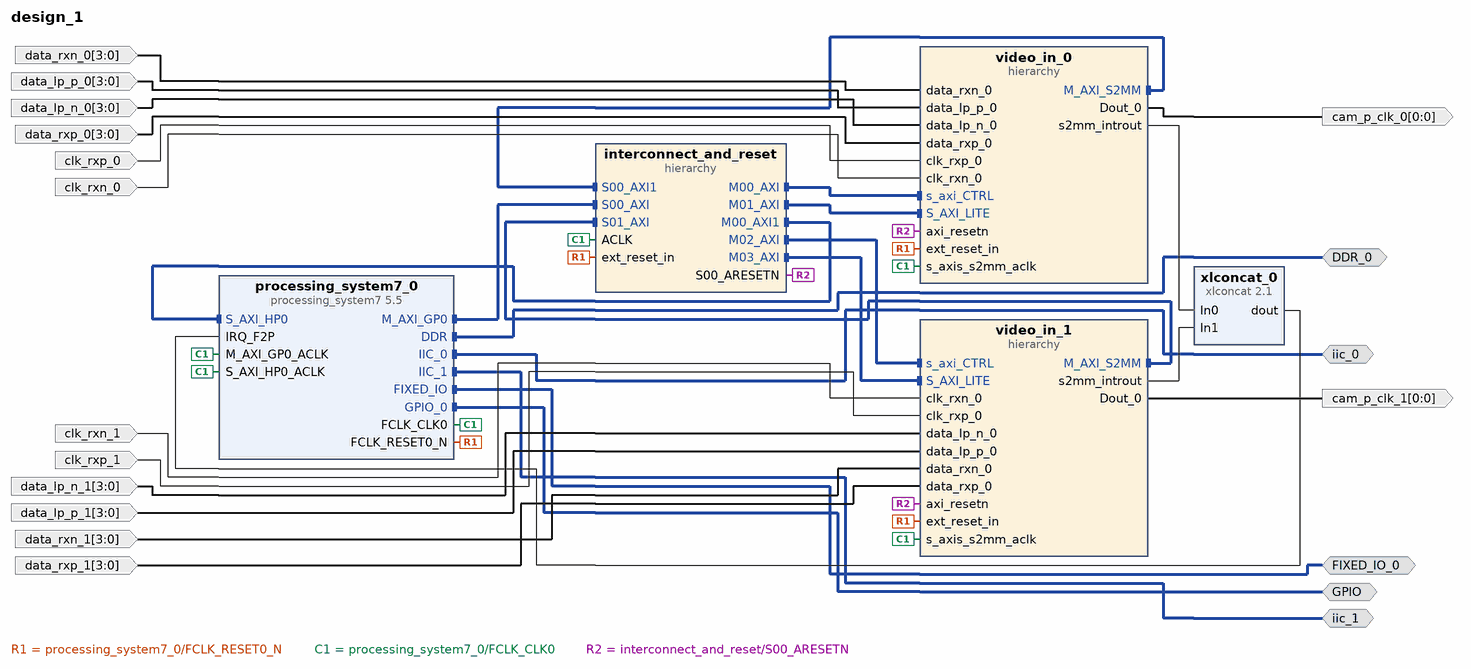
[diagram p0: block diagram of the top level]
# Vivado block design design_1, xc7z020clg484-1, Vivado 2018.2
create_bd_design design_1

create_bd_intf_port -mode Master -vlnv xilinx.com:interface:ddrx_rtl:1.0 DDR_0
create_bd_intf_port -mode Master -vlnv xilinx.com:interface:iic_rtl:1.0 iic_0
create_bd_intf_port -mode Master -vlnv xilinx.com:interface:iic_rtl:1.0 iic_1
create_bd_intf_port -mode Master -vlnv xilinx.com:display_processing_system7:fixedio_rtl:1.0 FIXED_IO_0
create_bd_intf_port -mode Master -vlnv xilinx.com:interface:gpio_rtl:1.0 GPIO
create_bd_port -dir I -from 3 -to 0 data_rxn_0
create_bd_port -dir I -from 3 -to 0 data_lp_p_0
create_bd_port -dir I -from 3 -to 0 data_lp_n_0
create_bd_port -dir I -from 3 -to 0 data_rxp_0
create_bd_port -dir I clk_rxp_0
create_bd_port -dir I clk_rxn_0
create_bd_port -dir O -from 0 -to 0 cam_p_clk_0
create_bd_port -dir O -from 0 -to 0 cam_p_clk_1
create_bd_port -dir I clk_rxn_1
create_bd_port -dir I clk_rxp_1
create_bd_port -dir I -from 3 -to 0 data_lp_n_1
create_bd_port -dir I -from 3 -to 0 data_lp_p_1
create_bd_port -dir I -from 3 -to 0 data_rxn_1
create_bd_port -dir I -from 3 -to 0 data_rxp_1

create_bd_cell -type hier video_in_0
create_bd_cell -type hier video_in_1
create_bd_cell -type hier interconnect_and_reset
create_bd_cell -type ip -vlnv xilinx.com:ip:processing_system7:5.5 processing_system7_0
set_property -dict [list \
  CONFIG.PCW_FCLK_CLK1_BUF TRUE \
  CONFIG.PCW_UIPARAM_DDR_FREQ_MHZ 533.333333 \
  CONFIG.PCW_CPU_CPU_6X4X_MAX_RANGE 800 \
  CONFIG.PCW_APU_PERIPHERAL_FREQMHZ 666.666666 \
  CONFIG.PCW_SDIO_PERIPHERAL_FREQMHZ 100 \
  CONFIG.PCW_UART_PERIPHERAL_FREQMHZ 100 \
  CONFIG.PCW_I2C_PERIPHERAL_FREQMHZ 111.111115 \
  CONFIG.PCW_FPGA0_PERIPHERAL_FREQMHZ 200 \
  CONFIG.PCW_FPGA1_PERIPHERAL_FREQMHZ 50 \
  CONFIG.PCW_USE_S_AXI_HP0 1 \
  CONFIG.PCW_USE_FABRIC_INTERRUPT 1 \
  CONFIG.PCW_EN_CLK1_PORT 1 \
  CONFIG.PCW_IRQ_F2P_INTR 1 \
  CONFIG.PCW_PERIPHERAL_BOARD_PRESET None \
  CONFIG.PCW_PRESET_BANK1_VOLTAGE {LVCMOS 3.3V} \
  CONFIG.PCW_UIPARAM_DDR_PARTNO {MT41J256M16 RE-125} \
  CONFIG.PCW_QSPI_PERIPHERAL_ENABLE 0 \
  CONFIG.PCW_ENET0_PERIPHERAL_ENABLE 1 \
  CONFIG.PCW_ENET0_ENET0_IO EMIO \
  CONFIG.PCW_ENET0_GRP_MDIO_ENABLE 1 \
  CONFIG.PCW_ENET0_GRP_MDIO_IO EMIO \
  CONFIG.PCW_ENET_RESET_ENABLE 1 \
  CONFIG.PCW_ENET_RESET_SELECT {Share reset pin} \
  CONFIG.PCW_ENET0_RESET_ENABLE 1 \
  CONFIG.PCW_ENET0_RESET_IO {MIO 0} \
  CONFIG.PCW_SD0_PERIPHERAL_ENABLE 1 \
  CONFIG.PCW_SD0_SD0_IO {MIO 40 .. 45} \
  CONFIG.PCW_SD0_GRP_CD_ENABLE 0 \
  CONFIG.PCW_SD0_GRP_WP_ENABLE 0 \
  CONFIG.PCW_UART0_PERIPHERAL_ENABLE 1 \
  CONFIG.PCW_UART0_UART0_IO EMIO \
  CONFIG.PCW_UART1_PERIPHERAL_ENABLE 0 \
  CONFIG.PCW_USB0_PERIPHERAL_ENABLE 1 \
  CONFIG.PCW_USB0_USB0_IO {MIO 28 .. 39} \
  CONFIG.PCW_USB_RESET_ENABLE 1 \
  CONFIG.PCW_USB_RESET_SELECT {Share reset pin} \
  CONFIG.PCW_USB0_RESET_ENABLE 1 \
  CONFIG.PCW_USB0_RESET_IO {MIO 4} \
  CONFIG.PCW_I2C0_PERIPHERAL_ENABLE 1 \
  CONFIG.PCW_I2C0_I2C0_IO EMIO \
  CONFIG.PCW_I2C0_RESET_ENABLE 1 \
  CONFIG.PCW_I2C0_RESET_IO {MIO 2} \
  CONFIG.PCW_I2C1_PERIPHERAL_ENABLE 1 \
  CONFIG.PCW_I2C1_I2C1_IO EMIO \
  CONFIG.PCW_I2C_RESET_ENABLE 1 \
  CONFIG.PCW_I2C_RESET_SELECT {Share reset pin} \
  CONFIG.PCW_GPIO_MIO_GPIO_ENABLE 1 \
  CONFIG.PCW_GPIO_MIO_GPIO_IO MIO \
  CONFIG.PCW_GPIO_EMIO_GPIO_ENABLE 1 \
  CONFIG.PCW_GPIO_EMIO_GPIO_IO 64 \
  CONFIG.PCW_FPGA_FCLK1_ENABLE 1 \
] [get_bd_cells processing_system7_0]
# 508 more settings of processing_system7_0 are not shown: defaults, MIO pin electricals, DDR timing, and values the tool derives
create_bd_cell -type ip -vlnv xilinx.com:ip:xlconcat:2.1 xlconcat_0

# ---- hierarchy /video_in_0 ----
current_bd_instance /video_in_0
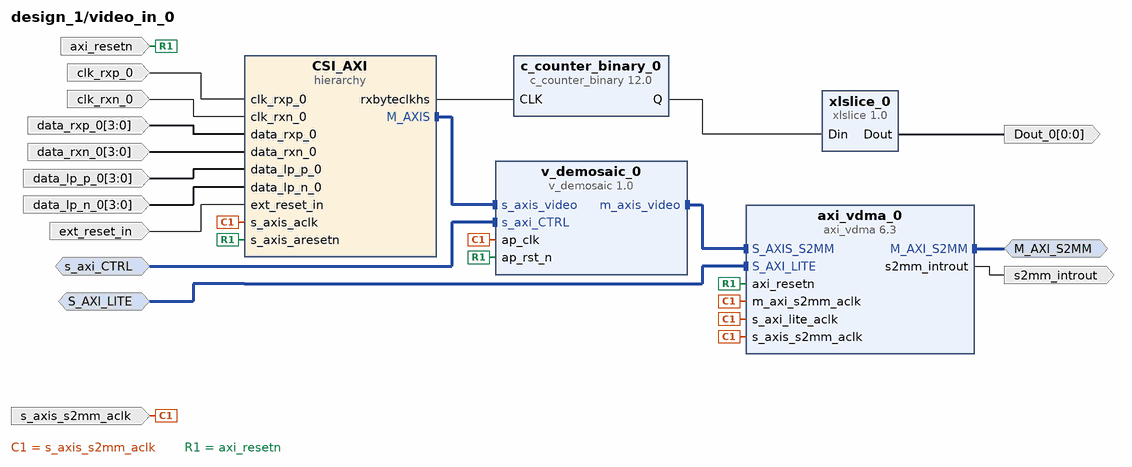
[diagram p1: block diagram inside /video_in_0]
create_bd_intf_pin -mode Master -vlnv xilinx.com:interface:aximm_rtl:1.0 M_AXI_S2MM
create_bd_intf_pin -mode Slave -vlnv xilinx.com:interface:aximm_rtl:1.0 s_axi_CTRL
create_bd_intf_pin -mode Slave -vlnv xilinx.com:interface:aximm_rtl:1.0 S_AXI_LITE
create_bd_pin -dir O -from 0 -to 0 Dout_0
create_bd_pin -dir I -type clk s_axis_s2mm_aclk
create_bd_pin -dir I -type rst axi_resetn
create_bd_pin -dir I clk_rxp_0
create_bd_pin -dir I clk_rxn_0
create_bd_pin -dir I -from 3 -to 0 data_rxp_0
create_bd_pin -dir I -from 3 -to 0 data_rxn_0
create_bd_pin -dir I -from 3 -to 0 data_lp_p_0
create_bd_pin -dir I -from 3 -to 0 data_lp_n_0
create_bd_pin -dir I -type rst ext_reset_in
create_bd_pin -dir O -type intr s2mm_introut

create_bd_cell -type hier CSI_AXI
create_bd_cell -type ip -vlnv xilinx.com:ip:axi_vdma:6.3 axi_vdma_0
set_property -dict [list \
  CONFIG.c_include_s2mm_dre 1 \
  CONFIG.c_s2mm_genlock_mode 0 \
  CONFIG.c_s2mm_linebuffer_depth 2048 \
  CONFIG.c_include_mm2s 0 \
  CONFIG.c_s2mm_max_burst_length 64 \
] [get_bd_cells axi_vdma_0]
create_bd_cell -type ip -vlnv xilinx.com:ip:c_counter_binary:12.0 c_counter_binary_0
set_property -dict {CONFIG.Output_Width 24} [get_bd_cells c_counter_binary_0]
create_bd_cell -type ip -vlnv xilinx.com:ip:v_demosaic:1.0 v_demosaic_0
set_property -dict [list \
  CONFIG.MAX_COLS 2560 \
  CONFIG.MAX_ROWS 1440 \
  CONFIG.MAX_DATA_WIDTH 10 \
  CONFIG.ENABLE_ZIPPER_REMOVAL false \
] [get_bd_cells v_demosaic_0]
create_bd_cell -type ip -vlnv xilinx.com:ip:xlslice:1.0 xlslice_0
set_property -dict {CONFIG.DIN_TO 23 CONFIG.DIN_FROM 23 CONFIG.DIN_WIDTH 24 CONFIG.DOUT_WIDTH 1} [get_bd_cells xlslice_0]

# ---- hierarchy /video_in_0/CSI_AXI ----
current_bd_instance /video_in_0/CSI_AXI
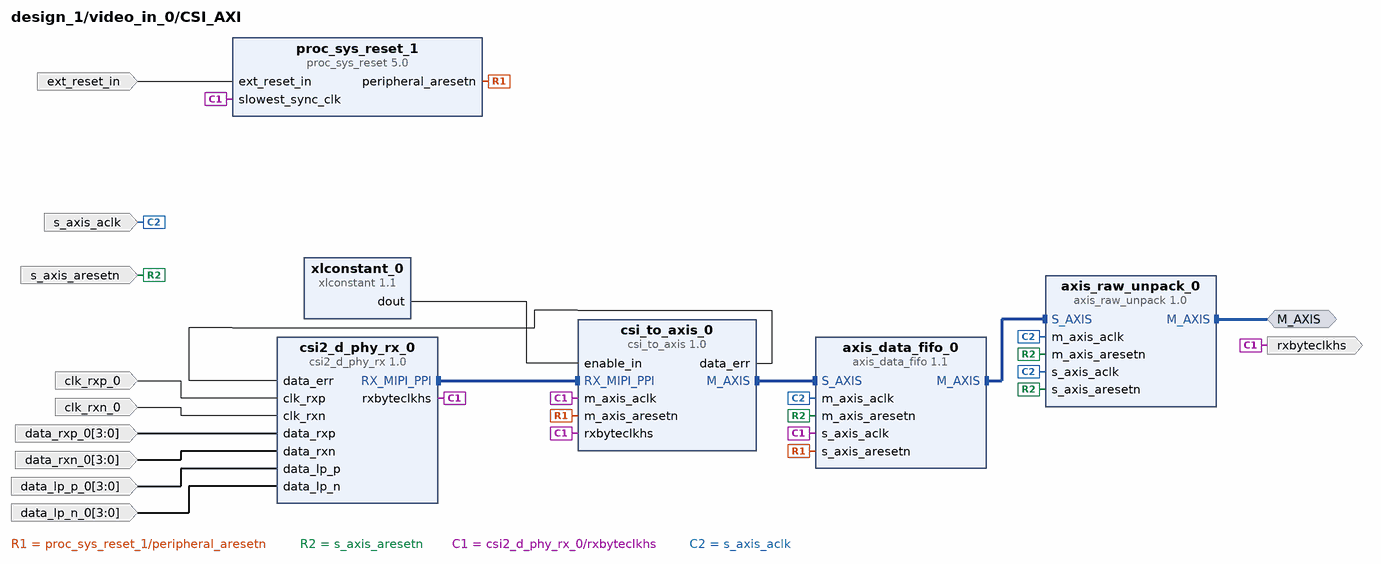
[diagram p2: block diagram inside /video_in_0/CSI_AXI]
create_bd_intf_pin -mode Master -vlnv xilinx.com:interface:axis_rtl:1.0 M_AXIS
create_bd_pin -dir I -type rst s_axis_aresetn
create_bd_pin -dir O rxbyteclkhs
create_bd_pin -dir I -type clk s_axis_aclk
create_bd_pin -dir I clk_rxp_0
create_bd_pin -dir I clk_rxn_0
create_bd_pin -dir I -from 3 -to 0 data_rxp_0
create_bd_pin -dir I -from 3 -to 0 data_rxn_0
create_bd_pin -dir I -from 3 -to 0 data_lp_p_0
create_bd_pin -dir I -from 3 -to 0 data_lp_n_0
create_bd_pin -dir I -type rst ext_reset_in

create_bd_cell -type ip -vlnv xilinx.com:ip:axis_data_fifo:1.1 axis_data_fifo_0
set_property -dict [list \
  CONFIG.TDATA_NUM_BYTES 4 \
  CONFIG.TUSER_WIDTH 1 \
  CONFIG.IS_ACLK_ASYNC 1 \
  CONFIG.HAS_TLAST 1 \
] [get_bd_cells axis_data_fifo_0]
create_bd_cell -type ip -vlnv trenz.biz:user:axis_raw_unpack:1.0 axis_raw_unpack_0
create_bd_cell -type ip -vlnv trenz.biz:user:csi2_d_phy_rx:1.0 csi2_d_phy_rx_0
set_property -dict {CONFIG.C_NUM_LANES 4 CONFIG.C_NUM_LP_LANES 4 CONFIG.C_USE_DELAY false} [get_bd_cells csi2_d_phy_rx_0]
create_bd_cell -type ip -vlnv trenz.biz:user:csi_to_axis:1.0 csi_to_axis_0
set_property -dict {CONFIG.C_LANES 4} [get_bd_cells csi_to_axis_0]
create_bd_cell -type ip -vlnv xilinx.com:ip:proc_sys_reset:5.0 proc_sys_reset_1
create_bd_cell -type ip -vlnv xilinx.com:ip:xlconstant:1.1 xlconstant_0

# ---- hierarchy /video_in_1 ----
current_bd_instance /video_in_1
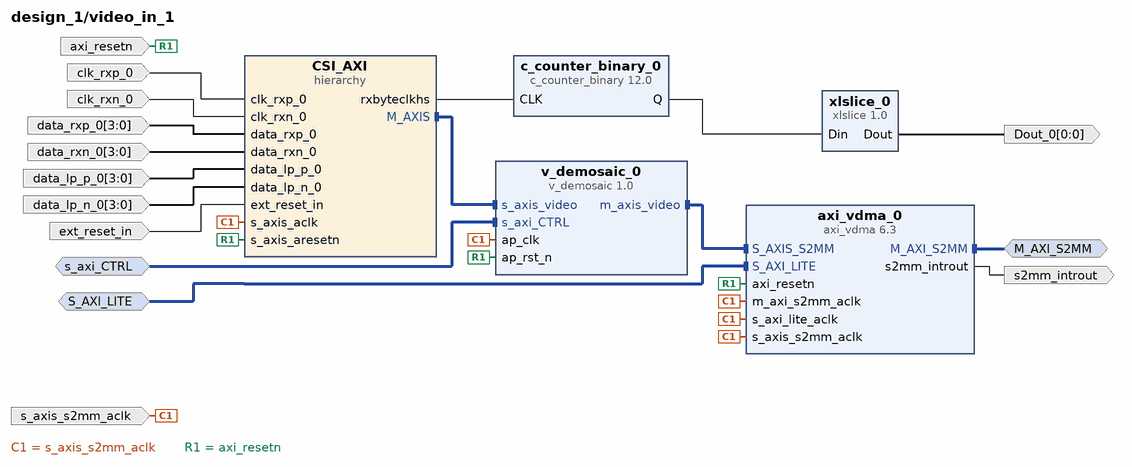
[diagram p3: block diagram inside /video_in_1]
create_bd_intf_pin -mode Master -vlnv xilinx.com:interface:aximm_rtl:1.0 M_AXI_S2MM
create_bd_intf_pin -mode Slave -vlnv xilinx.com:interface:aximm_rtl:1.0 s_axi_CTRL
create_bd_intf_pin -mode Slave -vlnv xilinx.com:interface:aximm_rtl:1.0 S_AXI_LITE
create_bd_pin -dir O -from 0 -to 0 Dout_0
create_bd_pin -dir I -type clk s_axis_s2mm_aclk
create_bd_pin -dir I -type rst axi_resetn
create_bd_pin -dir I clk_rxp_0
create_bd_pin -dir I clk_rxn_0
create_bd_pin -dir I -from 3 -to 0 data_rxp_0
create_bd_pin -dir I -from 3 -to 0 data_rxn_0
create_bd_pin -dir I -from 3 -to 0 data_lp_p_0
create_bd_pin -dir I -from 3 -to 0 data_lp_n_0
create_bd_pin -dir I -type rst ext_reset_in
create_bd_pin -dir O -type intr s2mm_introut

create_bd_cell -type hier CSI_AXI
create_bd_cell -type ip -vlnv xilinx.com:ip:axi_vdma:6.3 axi_vdma_0
set_property -dict [list \
  CONFIG.c_include_s2mm_dre 1 \
  CONFIG.c_s2mm_genlock_mode 0 \
  CONFIG.c_s2mm_linebuffer_depth 2048 \
  CONFIG.c_include_mm2s 0 \
  CONFIG.c_s2mm_max_burst_length 64 \
] [get_bd_cells axi_vdma_0]
create_bd_cell -type ip -vlnv xilinx.com:ip:c_counter_binary:12.0 c_counter_binary_0
set_property -dict {CONFIG.Output_Width 24} [get_bd_cells c_counter_binary_0]
create_bd_cell -type ip -vlnv xilinx.com:ip:v_demosaic:1.0 v_demosaic_0
set_property -dict [list \
  CONFIG.MAX_COLS 2560 \
  CONFIG.MAX_ROWS 1440 \
  CONFIG.MAX_DATA_WIDTH 10 \
  CONFIG.ENABLE_ZIPPER_REMOVAL false \
] [get_bd_cells v_demosaic_0]
create_bd_cell -type ip -vlnv xilinx.com:ip:xlslice:1.0 xlslice_0
set_property -dict {CONFIG.DIN_TO 23 CONFIG.DIN_FROM 23 CONFIG.DIN_WIDTH 24 CONFIG.DOUT_WIDTH 1} [get_bd_cells xlslice_0]

# ---- hierarchy /video_in_1/CSI_AXI ----
current_bd_instance /video_in_1/CSI_AXI
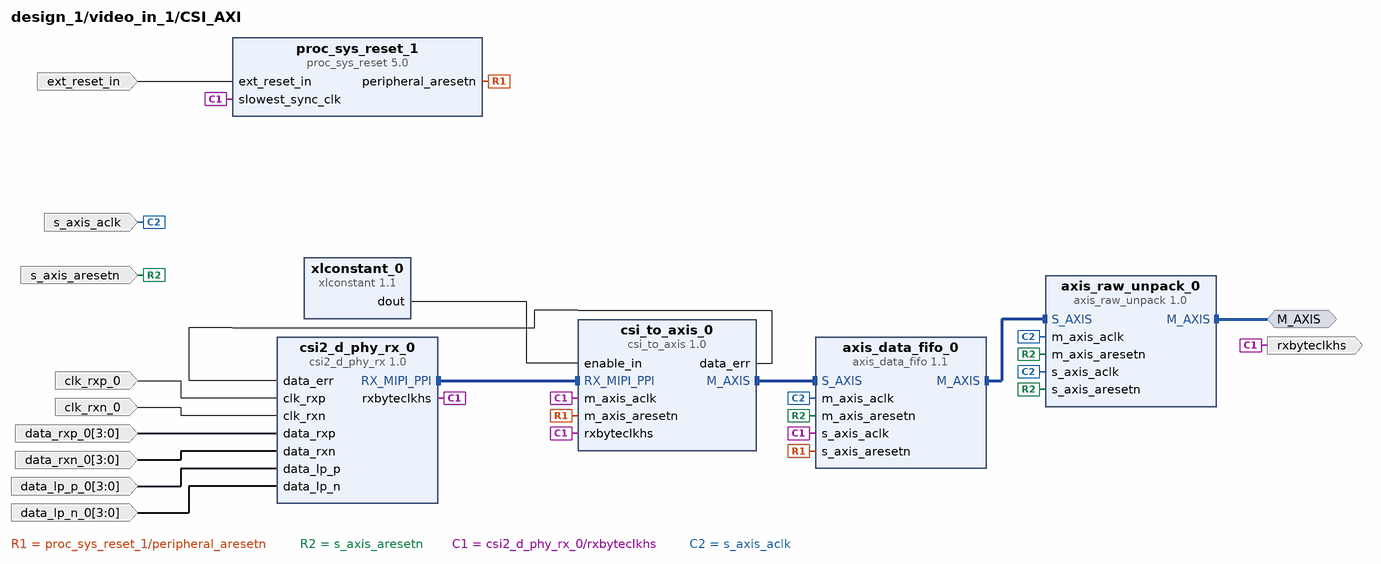
[diagram p4: block diagram inside /video_in_1/CSI_AXI]
create_bd_intf_pin -mode Master -vlnv xilinx.com:interface:axis_rtl:1.0 M_AXIS
create_bd_pin -dir I -type rst s_axis_aresetn
create_bd_pin -dir O rxbyteclkhs
create_bd_pin -dir I -type clk s_axis_aclk
create_bd_pin -dir I clk_rxp_0
create_bd_pin -dir I clk_rxn_0
create_bd_pin -dir I -from 3 -to 0 data_rxp_0
create_bd_pin -dir I -from 3 -to 0 data_rxn_0
create_bd_pin -dir I -from 3 -to 0 data_lp_p_0
create_bd_pin -dir I -from 3 -to 0 data_lp_n_0
create_bd_pin -dir I -type rst ext_reset_in

create_bd_cell -type ip -vlnv xilinx.com:ip:axis_data_fifo:1.1 axis_data_fifo_0
set_property -dict [list \
  CONFIG.TDATA_NUM_BYTES 4 \
  CONFIG.TUSER_WIDTH 1 \
  CONFIG.IS_ACLK_ASYNC 1 \
  CONFIG.HAS_TLAST 1 \
] [get_bd_cells axis_data_fifo_0]
create_bd_cell -type ip -vlnv trenz.biz:user:axis_raw_unpack:1.0 axis_raw_unpack_0
create_bd_cell -type ip -vlnv trenz.biz:user:csi2_d_phy_rx:1.0 csi2_d_phy_rx_0
set_property -dict {CONFIG.C_NUM_LANES 4 CONFIG.C_NUM_LP_LANES 4 CONFIG.C_USE_DELAY false} [get_bd_cells csi2_d_phy_rx_0]
create_bd_cell -type ip -vlnv trenz.biz:user:csi_to_axis:1.0 csi_to_axis_0
set_property -dict {CONFIG.C_LANES 4} [get_bd_cells csi_to_axis_0]
create_bd_cell -type ip -vlnv xilinx.com:ip:proc_sys_reset:5.0 proc_sys_reset_1
create_bd_cell -type ip -vlnv xilinx.com:ip:xlconstant:1.1 xlconstant_0

# ---- hierarchy /interconnect_and_reset ----
current_bd_instance /interconnect_and_reset
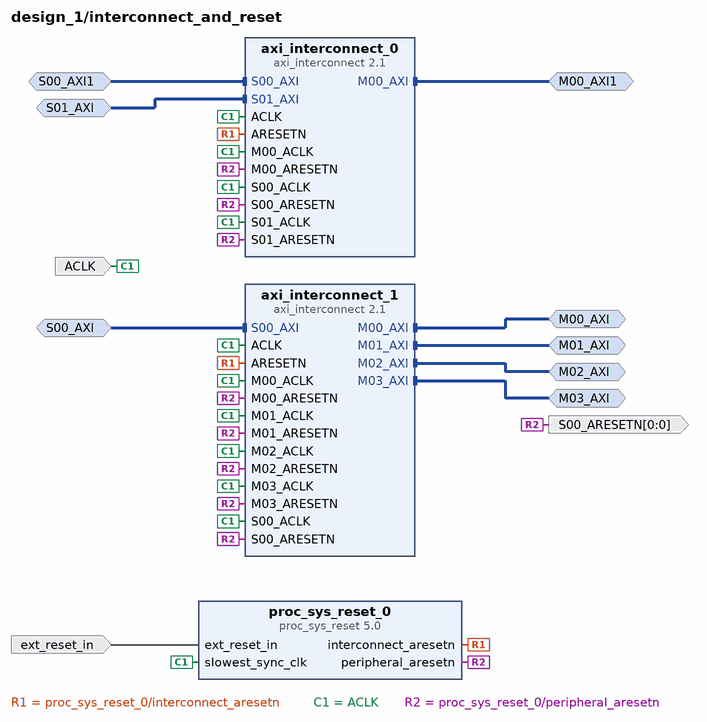
[diagram p5: block diagram inside /interconnect_and_reset]
create_bd_intf_pin -mode Slave -vlnv xilinx.com:interface:aximm_rtl:1.0 S00_AXI
create_bd_intf_pin -mode Master -vlnv xilinx.com:interface:aximm_rtl:1.0 M00_AXI
create_bd_intf_pin -mode Master -vlnv xilinx.com:interface:aximm_rtl:1.0 M01_AXI
create_bd_intf_pin -mode Master -vlnv xilinx.com:interface:aximm_rtl:1.0 M02_AXI
create_bd_intf_pin -mode Master -vlnv xilinx.com:interface:aximm_rtl:1.0 M03_AXI
create_bd_intf_pin -mode Slave -vlnv xilinx.com:interface:aximm_rtl:1.0 S00_AXI1
create_bd_intf_pin -mode Master -vlnv xilinx.com:interface:aximm_rtl:1.0 M00_AXI1
create_bd_intf_pin -mode Slave -vlnv xilinx.com:interface:aximm_rtl:1.0 S01_AXI
create_bd_pin -dir I -type clk ACLK
create_bd_pin -dir I -type rst ext_reset_in
create_bd_pin -dir O -from 0 -to 0 -type rst S00_ARESETN

create_bd_cell -type ip -vlnv xilinx.com:ip:axi_interconnect:2.1 axi_interconnect_0
set_property -dict {CONFIG.NUM_SI 2 CONFIG.NUM_MI 1} [get_bd_cells axi_interconnect_0]
create_bd_cell -type ip -vlnv xilinx.com:ip:axi_interconnect:2.1 axi_interconnect_1
set_property -dict {CONFIG.NUM_SI 1 CONFIG.NUM_MI 4} [get_bd_cells axi_interconnect_1]
create_bd_cell -type ip -vlnv xilinx.com:ip:proc_sys_reset:5.0 proc_sys_reset_0

# ---- connections ----

current_bd_instance /video_in_0
connect_bd_intf_net [get_bd_intf_pins CSI_AXI/M_AXIS] [get_bd_intf_pins v_demosaic_0/s_axis_video]
connect_bd_intf_net [get_bd_intf_pins v_demosaic_0/m_axis_video] [get_bd_intf_pins axi_vdma_0/S_AXIS_S2MM]
connect_bd_intf_net [get_bd_intf_pins M_AXI_S2MM] [get_bd_intf_pins axi_vdma_0/M_AXI_S2MM]
connect_bd_intf_net [get_bd_intf_pins s_axi_CTRL] [get_bd_intf_pins v_demosaic_0/s_axi_CTRL]
connect_bd_intf_net [get_bd_intf_pins S_AXI_LITE] [get_bd_intf_pins axi_vdma_0/S_AXI_LITE]
connect_bd_net [get_bd_pins c_counter_binary_0/Q] [get_bd_pins xlslice_0/Din]
connect_bd_net -net csi2_d_phy_rx_0_rxbyteclkhs [get_bd_pins CSI_AXI/rxbyteclkhs] [get_bd_pins c_counter_binary_0/CLK]
connect_bd_net [get_bd_pins xlslice_0/Dout] [get_bd_pins Dout_0]
connect_bd_net -net processing_system7_0_FCLK_CLK0 [get_bd_pins s_axis_s2mm_aclk] \
  [get_bd_pins CSI_AXI/s_axis_aclk] [get_bd_pins axi_vdma_0/s_axi_lite_aclk] [get_bd_pins axi_vdma_0/m_axi_s2mm_aclk] \
  [get_bd_pins axi_vdma_0/s_axis_s2mm_aclk] [get_bd_pins v_demosaic_0/ap_clk]
connect_bd_net -net proc_sys_reset_0_peripheral_aresetn1 [get_bd_pins axi_resetn] \
  [get_bd_pins CSI_AXI/s_axis_aresetn] [get_bd_pins axi_vdma_0/axi_resetn] [get_bd_pins v_demosaic_0/ap_rst_n]
connect_bd_net -net clk_rxp_0_1 [get_bd_pins clk_rxp_0] [get_bd_pins CSI_AXI/clk_rxp_0]
connect_bd_net -net clk_rxn_0_1 [get_bd_pins clk_rxn_0] [get_bd_pins CSI_AXI/clk_rxn_0]
connect_bd_net -net data_rxp_0_1 [get_bd_pins data_rxp_0] [get_bd_pins CSI_AXI/data_rxp_0]
connect_bd_net -net data_rxn_0_1 [get_bd_pins data_rxn_0] [get_bd_pins CSI_AXI/data_rxn_0]
connect_bd_net -net data_lp_p_0_1 [get_bd_pins data_lp_p_0] [get_bd_pins CSI_AXI/data_lp_p_0]
connect_bd_net -net data_lp_n_0_1 [get_bd_pins data_lp_n_0] [get_bd_pins CSI_AXI/data_lp_n_0]
connect_bd_net -net processing_system7_0_FCLK_RESET0_N [get_bd_pins ext_reset_in] [get_bd_pins CSI_AXI/ext_reset_in]
connect_bd_net [get_bd_pins axi_vdma_0/s2mm_introut] [get_bd_pins s2mm_introut]

current_bd_instance /video_in_0/CSI_AXI
connect_bd_intf_net [get_bd_intf_pins csi_to_axis_0/M_AXIS] [get_bd_intf_pins axis_data_fifo_0/S_AXIS]
connect_bd_intf_net [get_bd_intf_pins axis_data_fifo_0/M_AXIS] [get_bd_intf_pins axis_raw_unpack_0/S_AXIS]
connect_bd_intf_net [get_bd_intf_pins csi2_d_phy_rx_0/RX_MIPI_PPI] [get_bd_intf_pins csi_to_axis_0/RX_MIPI_PPI]
connect_bd_intf_net [get_bd_intf_pins M_AXIS] [get_bd_intf_pins axis_raw_unpack_0/M_AXIS]
connect_bd_net -net proc_sys_reset_0_peripheral_aresetn [get_bd_pins proc_sys_reset_1/peripheral_aresetn] \
  [get_bd_pins axis_data_fifo_0/s_axis_aresetn] [get_bd_pins csi_to_axis_0/m_axis_aresetn]
connect_bd_net [get_bd_pins xlconstant_0/dout] [get_bd_pins csi_to_axis_0/enable_in]
connect_bd_net [get_bd_pins csi_to_axis_0/data_err] [get_bd_pins csi2_d_phy_rx_0/data_err]
connect_bd_net -net proc_sys_reset_0_peripheral_aresetn1 [get_bd_pins s_axis_aresetn] \
  [get_bd_pins axis_data_fifo_0/m_axis_aresetn] [get_bd_pins axis_raw_unpack_0/s_axis_aresetn] \
  [get_bd_pins axis_raw_unpack_0/m_axis_aresetn]
connect_bd_net [get_bd_pins csi2_d_phy_rx_0/rxbyteclkhs] \
  [get_bd_pins rxbyteclkhs] [get_bd_pins axis_data_fifo_0/s_axis_aclk] [get_bd_pins csi_to_axis_0/rxbyteclkhs] \
  [get_bd_pins csi_to_axis_0/m_axis_aclk] [get_bd_pins proc_sys_reset_1/slowest_sync_clk]
connect_bd_net -net processing_system7_0_FCLK_CLK0 [get_bd_pins s_axis_aclk] \
  [get_bd_pins axis_data_fifo_0/m_axis_aclk] [get_bd_pins axis_raw_unpack_0/s_axis_aclk] \
  [get_bd_pins axis_raw_unpack_0/m_axis_aclk]
connect_bd_net -net clk_rxp_0_1 [get_bd_pins clk_rxp_0] [get_bd_pins csi2_d_phy_rx_0/clk_rxp]
connect_bd_net -net clk_rxn_0_1 [get_bd_pins clk_rxn_0] [get_bd_pins csi2_d_phy_rx_0/clk_rxn]
connect_bd_net -net data_rxp_0_1 [get_bd_pins data_rxp_0] [get_bd_pins csi2_d_phy_rx_0/data_rxp]
connect_bd_net -net data_rxn_0_1 [get_bd_pins data_rxn_0] [get_bd_pins csi2_d_phy_rx_0/data_rxn]
connect_bd_net -net data_lp_p_0_1 [get_bd_pins data_lp_p_0] [get_bd_pins csi2_d_phy_rx_0/data_lp_p]
connect_bd_net -net data_lp_n_0_1 [get_bd_pins data_lp_n_0] [get_bd_pins csi2_d_phy_rx_0/data_lp_n]
connect_bd_net -net processing_system7_0_FCLK_RESET0_N [get_bd_pins ext_reset_in] [get_bd_pins proc_sys_reset_1/ext_reset_in]

current_bd_instance /video_in_1
connect_bd_intf_net [get_bd_intf_pins CSI_AXI/M_AXIS] [get_bd_intf_pins v_demosaic_0/s_axis_video]
connect_bd_intf_net [get_bd_intf_pins v_demosaic_0/m_axis_video] [get_bd_intf_pins axi_vdma_0/S_AXIS_S2MM]
connect_bd_intf_net [get_bd_intf_pins M_AXI_S2MM] [get_bd_intf_pins axi_vdma_0/M_AXI_S2MM]
connect_bd_intf_net [get_bd_intf_pins s_axi_CTRL] [get_bd_intf_pins v_demosaic_0/s_axi_CTRL]
connect_bd_intf_net [get_bd_intf_pins S_AXI_LITE] [get_bd_intf_pins axi_vdma_0/S_AXI_LITE]
connect_bd_net [get_bd_pins c_counter_binary_0/Q] [get_bd_pins xlslice_0/Din]
connect_bd_net -net csi2_d_phy_rx_0_rxbyteclkhs [get_bd_pins CSI_AXI/rxbyteclkhs] [get_bd_pins c_counter_binary_0/CLK]
connect_bd_net [get_bd_pins xlslice_0/Dout] [get_bd_pins Dout_0]
connect_bd_net -net processing_system7_0_FCLK_CLK0 [get_bd_pins s_axis_s2mm_aclk] \
  [get_bd_pins CSI_AXI/s_axis_aclk] [get_bd_pins axi_vdma_0/s_axi_lite_aclk] [get_bd_pins axi_vdma_0/m_axi_s2mm_aclk] \
  [get_bd_pins axi_vdma_0/s_axis_s2mm_aclk] [get_bd_pins v_demosaic_0/ap_clk]
connect_bd_net -net proc_sys_reset_0_peripheral_aresetn1 [get_bd_pins axi_resetn] \
  [get_bd_pins CSI_AXI/s_axis_aresetn] [get_bd_pins axi_vdma_0/axi_resetn] [get_bd_pins v_demosaic_0/ap_rst_n]
connect_bd_net -net clk_rxp_0_1 [get_bd_pins clk_rxp_0] [get_bd_pins CSI_AXI/clk_rxp_0]
connect_bd_net -net clk_rxn_0_1 [get_bd_pins clk_rxn_0] [get_bd_pins CSI_AXI/clk_rxn_0]
connect_bd_net -net data_rxp_0_1 [get_bd_pins data_rxp_0] [get_bd_pins CSI_AXI/data_rxp_0]
connect_bd_net -net data_rxn_0_1 [get_bd_pins data_rxn_0] [get_bd_pins CSI_AXI/data_rxn_0]
connect_bd_net -net data_lp_p_0_1 [get_bd_pins data_lp_p_0] [get_bd_pins CSI_AXI/data_lp_p_0]
connect_bd_net -net data_lp_n_0_1 [get_bd_pins data_lp_n_0] [get_bd_pins CSI_AXI/data_lp_n_0]
connect_bd_net -net processing_system7_0_FCLK_RESET0_N [get_bd_pins ext_reset_in] [get_bd_pins CSI_AXI/ext_reset_in]
connect_bd_net [get_bd_pins axi_vdma_0/s2mm_introut] [get_bd_pins s2mm_introut]

current_bd_instance /video_in_1/CSI_AXI
connect_bd_intf_net [get_bd_intf_pins csi_to_axis_0/M_AXIS] [get_bd_intf_pins axis_data_fifo_0/S_AXIS]
connect_bd_intf_net [get_bd_intf_pins axis_data_fifo_0/M_AXIS] [get_bd_intf_pins axis_raw_unpack_0/S_AXIS]
connect_bd_intf_net [get_bd_intf_pins csi2_d_phy_rx_0/RX_MIPI_PPI] [get_bd_intf_pins csi_to_axis_0/RX_MIPI_PPI]
connect_bd_intf_net [get_bd_intf_pins M_AXIS] [get_bd_intf_pins axis_raw_unpack_0/M_AXIS]
connect_bd_net -net proc_sys_reset_0_peripheral_aresetn [get_bd_pins proc_sys_reset_1/peripheral_aresetn] \
  [get_bd_pins axis_data_fifo_0/s_axis_aresetn] [get_bd_pins csi_to_axis_0/m_axis_aresetn]
connect_bd_net [get_bd_pins xlconstant_0/dout] [get_bd_pins csi_to_axis_0/enable_in]
connect_bd_net [get_bd_pins csi_to_axis_0/data_err] [get_bd_pins csi2_d_phy_rx_0/data_err]
connect_bd_net -net proc_sys_reset_0_peripheral_aresetn1 [get_bd_pins s_axis_aresetn] \
  [get_bd_pins axis_data_fifo_0/m_axis_aresetn] [get_bd_pins axis_raw_unpack_0/s_axis_aresetn] \
  [get_bd_pins axis_raw_unpack_0/m_axis_aresetn]
connect_bd_net [get_bd_pins csi2_d_phy_rx_0/rxbyteclkhs] \
  [get_bd_pins rxbyteclkhs] [get_bd_pins axis_data_fifo_0/s_axis_aclk] [get_bd_pins csi_to_axis_0/rxbyteclkhs] \
  [get_bd_pins csi_to_axis_0/m_axis_aclk] [get_bd_pins proc_sys_reset_1/slowest_sync_clk]
connect_bd_net -net processing_system7_0_FCLK_CLK0 [get_bd_pins s_axis_aclk] \
  [get_bd_pins axis_data_fifo_0/m_axis_aclk] [get_bd_pins axis_raw_unpack_0/s_axis_aclk] \
  [get_bd_pins axis_raw_unpack_0/m_axis_aclk]
connect_bd_net -net clk_rxp_0_1 [get_bd_pins clk_rxp_0] [get_bd_pins csi2_d_phy_rx_0/clk_rxp]
connect_bd_net -net clk_rxn_0_1 [get_bd_pins clk_rxn_0] [get_bd_pins csi2_d_phy_rx_0/clk_rxn]
connect_bd_net -net data_rxp_0_1 [get_bd_pins data_rxp_0] [get_bd_pins csi2_d_phy_rx_0/data_rxp]
connect_bd_net -net data_rxn_0_1 [get_bd_pins data_rxn_0] [get_bd_pins csi2_d_phy_rx_0/data_rxn]
connect_bd_net -net data_lp_p_0_1 [get_bd_pins data_lp_p_0] [get_bd_pins csi2_d_phy_rx_0/data_lp_p]
connect_bd_net -net data_lp_n_0_1 [get_bd_pins data_lp_n_0] [get_bd_pins csi2_d_phy_rx_0/data_lp_n]
connect_bd_net -net processing_system7_0_FCLK_RESET0_N [get_bd_pins ext_reset_in] [get_bd_pins proc_sys_reset_1/ext_reset_in]

current_bd_instance /interconnect_and_reset
connect_bd_intf_net [get_bd_intf_pins S00_AXI] [get_bd_intf_pins axi_interconnect_1/S00_AXI]
connect_bd_intf_net [get_bd_intf_pins M00_AXI] [get_bd_intf_pins axi_interconnect_1/M00_AXI]
connect_bd_intf_net [get_bd_intf_pins M01_AXI] [get_bd_intf_pins axi_interconnect_1/M01_AXI]
connect_bd_intf_net [get_bd_intf_pins M02_AXI] [get_bd_intf_pins axi_interconnect_1/M02_AXI]
connect_bd_intf_net [get_bd_intf_pins M03_AXI] [get_bd_intf_pins axi_interconnect_1/M03_AXI]
connect_bd_intf_net [get_bd_intf_pins S00_AXI1] [get_bd_intf_pins axi_interconnect_0/S00_AXI]
connect_bd_intf_net [get_bd_intf_pins M00_AXI1] [get_bd_intf_pins axi_interconnect_0/M00_AXI]
connect_bd_intf_net [get_bd_intf_pins S01_AXI] [get_bd_intf_pins axi_interconnect_0/S01_AXI]
connect_bd_net -net ARESETN_1 [get_bd_pins proc_sys_reset_0/interconnect_aresetn] \
  [get_bd_pins axi_interconnect_0/ARESETN] [get_bd_pins axi_interconnect_1/ARESETN]
connect_bd_net -net processing_system7_0_FCLK_CLK0 [get_bd_pins ACLK] \
  [get_bd_pins axi_interconnect_0/ACLK] [get_bd_pins axi_interconnect_0/S00_ACLK] [get_bd_pins axi_interconnect_0/M00_ACLK] \
  [get_bd_pins axi_interconnect_0/S01_ACLK] [get_bd_pins axi_interconnect_1/ACLK] [get_bd_pins axi_interconnect_1/S00_ACLK] \
  [get_bd_pins axi_interconnect_1/M00_ACLK] [get_bd_pins axi_interconnect_1/M01_ACLK] \
  [get_bd_pins axi_interconnect_1/M02_ACLK] [get_bd_pins axi_interconnect_1/M03_ACLK] \
  [get_bd_pins proc_sys_reset_0/slowest_sync_clk]
connect_bd_net -net processing_system7_0_FCLK_RESET0_N [get_bd_pins ext_reset_in] [get_bd_pins proc_sys_reset_0/ext_reset_in]
connect_bd_net [get_bd_pins proc_sys_reset_0/peripheral_aresetn] \
  [get_bd_pins S00_ARESETN] [get_bd_pins axi_interconnect_0/S00_ARESETN] [get_bd_pins axi_interconnect_0/M00_ARESETN] \
  [get_bd_pins axi_interconnect_0/S01_ARESETN] [get_bd_pins axi_interconnect_1/S00_ARESETN] \
  [get_bd_pins axi_interconnect_1/M00_ARESETN] [get_bd_pins axi_interconnect_1/M01_ARESETN] \
  [get_bd_pins axi_interconnect_1/M02_ARESETN] [get_bd_pins axi_interconnect_1/M03_ARESETN]

current_bd_instance /
connect_bd_intf_net [get_bd_intf_pins interconnect_and_reset/S01_AXI] [get_bd_intf_pins video_in_1/M_AXI_S2MM]
connect_bd_intf_net [get_bd_intf_pins interconnect_and_reset/S00_AXI1] [get_bd_intf_pins video_in_0/M_AXI_S2MM]
connect_bd_intf_net [get_bd_intf_pins interconnect_and_reset/M00_AXI1] [get_bd_intf_pins processing_system7_0/S_AXI_HP0]
connect_bd_intf_net [get_bd_intf_pins interconnect_and_reset/S00_AXI] [get_bd_intf_pins processing_system7_0/M_AXI_GP0]
connect_bd_intf_net [get_bd_intf_pins interconnect_and_reset/M00_AXI] [get_bd_intf_pins video_in_0/s_axi_CTRL]
connect_bd_intf_net [get_bd_intf_pins interconnect_and_reset/M01_AXI] [get_bd_intf_pins video_in_0/S_AXI_LITE]
connect_bd_intf_net [get_bd_intf_pins interconnect_and_reset/M02_AXI] [get_bd_intf_pins video_in_1/s_axi_CTRL]
connect_bd_intf_net [get_bd_intf_pins interconnect_and_reset/M03_AXI] [get_bd_intf_pins video_in_1/S_AXI_LITE]
connect_bd_intf_net [get_bd_intf_ports DDR_0] [get_bd_intf_pins processing_system7_0/DDR]
connect_bd_intf_net [get_bd_intf_ports iic_0] [get_bd_intf_pins processing_system7_0/IIC_0]
connect_bd_intf_net [get_bd_intf_ports iic_1] [get_bd_intf_pins processing_system7_0/IIC_1]
connect_bd_intf_net [get_bd_intf_ports FIXED_IO_0] [get_bd_intf_pins processing_system7_0/FIXED_IO]
connect_bd_intf_net [get_bd_intf_ports GPIO] [get_bd_intf_pins processing_system7_0/GPIO_0]
connect_bd_net -net data_rxn_0_1 [get_bd_ports data_rxn_0] [get_bd_pins video_in_0/data_rxn_0]
connect_bd_net -net data_lp_p_0_1 [get_bd_ports data_lp_p_0] [get_bd_pins video_in_0/data_lp_p_0]
connect_bd_net -net data_lp_n_0_1 [get_bd_ports data_lp_n_0] [get_bd_pins video_in_0/data_lp_n_0]
connect_bd_net -net data_rxp_0_1 [get_bd_ports data_rxp_0] [get_bd_pins video_in_0/data_rxp_0]
connect_bd_net -net clk_rxp_0_1 [get_bd_ports clk_rxp_0] [get_bd_pins video_in_0/clk_rxp_0]
connect_bd_net -net clk_rxn_0_1 [get_bd_ports clk_rxn_0] [get_bd_pins video_in_0/clk_rxn_0]
connect_bd_net [get_bd_pins processing_system7_0/FCLK_RESET0_N] \
  [get_bd_pins video_in_0/ext_reset_in] [get_bd_pins video_in_1/ext_reset_in] \
  [get_bd_pins interconnect_and_reset/ext_reset_in]
connect_bd_net -net xlslice_0_Dout [get_bd_pins video_in_0/Dout_0] [get_bd_ports cam_p_clk_0]
connect_bd_net [get_bd_pins processing_system7_0/FCLK_CLK0] \
  [get_bd_pins video_in_0/s_axis_s2mm_aclk] [get_bd_pins video_in_1/s_axis_s2mm_aclk] \
  [get_bd_pins interconnect_and_reset/ACLK] [get_bd_pins processing_system7_0/M_AXI_GP0_ACLK] \
  [get_bd_pins processing_system7_0/S_AXI_HP0_ACLK]
connect_bd_net -net proc_sys_reset_0_peripheral_aresetn1 [get_bd_pins interconnect_and_reset/S00_ARESETN] \
  [get_bd_pins video_in_0/axi_resetn] [get_bd_pins video_in_1/axi_resetn]
connect_bd_net -net clk_rxn_0_2 [get_bd_ports clk_rxn_1] [get_bd_pins video_in_1/clk_rxn_0]
connect_bd_net -net clk_rxp_0_2 [get_bd_ports clk_rxp_1] [get_bd_pins video_in_1/clk_rxp_0]
connect_bd_net -net data_lp_n_0_2 [get_bd_ports data_lp_n_1] [get_bd_pins video_in_1/data_lp_n_0]
connect_bd_net -net data_lp_p_0_2 [get_bd_ports data_lp_p_1] [get_bd_pins video_in_1/data_lp_p_0]
connect_bd_net -net data_rxn_0_2 [get_bd_ports data_rxn_1] [get_bd_pins video_in_1/data_rxn_0]
connect_bd_net -net data_rxp_0_2 [get_bd_ports data_rxp_1] [get_bd_pins video_in_1/data_rxp_0]
connect_bd_net -net xlslice_0_Dout1 [get_bd_pins video_in_1/Dout_0] [get_bd_ports cam_p_clk_1]
connect_bd_net [get_bd_pins xlconcat_0/dout] [get_bd_pins processing_system7_0/IRQ_F2P]
connect_bd_net -net video_in_s2mm_introut [get_bd_pins video_in_0/s2mm_introut] [get_bd_pins xlconcat_0/In0]
connect_bd_net -net video_in1_s2mm_introut [get_bd_pins video_in_1/s2mm_introut] [get_bd_pins xlconcat_0/In1]

# ---- address map ----
assign_bd_address -offset 0x43000000 -range 64K -target_address_space [get_bd_addr_spaces processing_system7_0/Data] [get_bd_addr_segs video_in_0/axi_vdma_0/S_AXI_LITE/Reg]
assign_bd_address -offset 0x43010000 -range 64K -target_address_space [get_bd_addr_spaces processing_system7_0/Data] [get_bd_addr_segs video_in_1/axi_vdma_0/S_AXI_LITE/Reg]
assign_bd_address -offset 0x43C00000 -range 64K -target_address_space [get_bd_addr_spaces processing_system7_0/Data] [get_bd_addr_segs video_in_0/v_demosaic_0/s_axi_CTRL/Reg]
assign_bd_address -offset 0x43C10000 -range 64K -target_address_space [get_bd_addr_spaces processing_system7_0/Data] [get_bd_addr_segs video_in_1/v_demosaic_0/s_axi_CTRL/Reg]
assign_bd_address -offset 0x00000000 -range 1G -target_address_space [get_bd_addr_spaces video_in_0/axi_vdma_0/Data_S2MM] [get_bd_addr_segs processing_system7_0/S_AXI_HP0/HP0_DDR_LOWOCM]
assign_bd_address -offset 0x00000000 -range 1G -target_address_space [get_bd_addr_spaces video_in_1/axi_vdma_0/Data_S2MM] [get_bd_addr_segs processing_system7_0/S_AXI_HP0/HP0_DDR_LOWOCM]

validate_bd_design
save_bd_design
